# Altium schematic sheet Boost Converter.SchDoc
size B; SheetNumber: 2; SheetTotal: 7
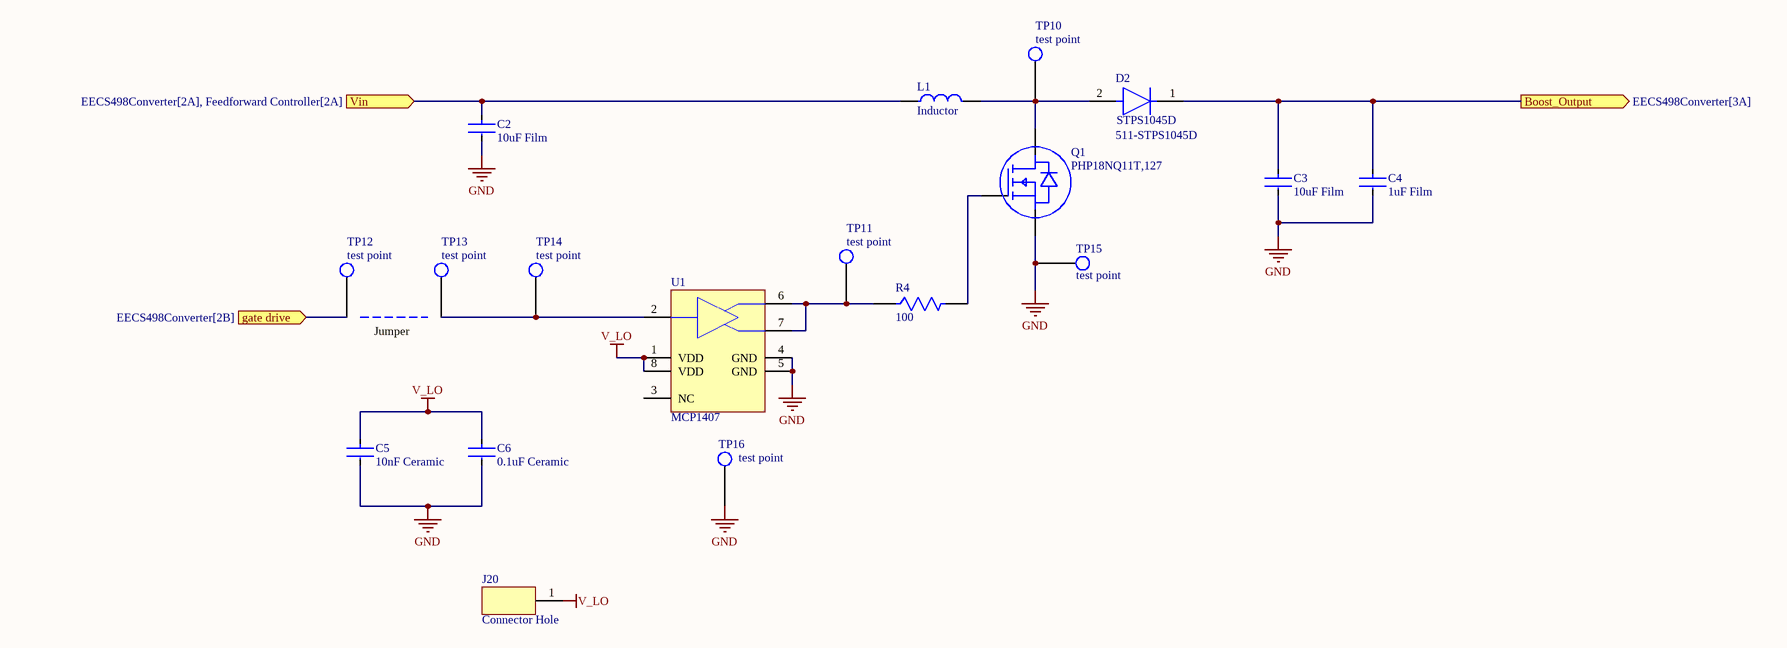
[diagram p0: Boost Converter.SchDoc]

## Parts
C2  10uF Film  [FP-FILM-CAP-22.5mm]
C3  10uF Film  [FP-FILM-CAP-22.5mm]
C4  1uF Film  [FP-FILM-CAP-10mm]
C5  10nF Ceramic  [FP-K15H5-MFG]
C6  0.1uF Ceramic  [FP-K15H5-MFG]
D2  STPS1045D  Supplier Part Number 1: 511-STPS1045D  [STPS1045D]
J20  Connector Hole  [Connector Hole]
L1  Inductor  [Power Inductor]
Q1  PHP18NQ11T,127  [1727-PHP18NQ11T,127-ND]
R4  100  [FP-RLR07-MFG]
TP10  test point  [test point]
TP11  test point  [test point]
TP12  test point  [test point]
TP13  test point  [test point]
TP14  test point  [test point]
TP15  test point  [test point]
TP16  test point  [test point]
U1  MCP1407  [DIP8]

## Ports
Boost_Output (out, see EECS498Converter[3A]), gate drive (in, see EECS498Converter[2B]), Vin (in, see EECS498Converter[2A], Feedforward Controller[2A])

## Nets
GND: C2.2 C3.2 C4.2 C5.2 C6.2 Q1.3(S) TP15.1 TP16.1 U1.4(GND) U1.5(GND)
V_LO: C5.1 C6.1 J20.1 U1.1(VDD) U1.8(VDD)
Boost_Output: C3.1 C4.1 D2.1(K) ; port Boost_Output
gate drive: TP12.1 ; port gate drive
Vin: C2.1 L1.1 ; port Vin
NetD2_2: D2.2(A) L1.2 Q1.2(D) TP10.1
NetQ1_1: Q1.1(G) R4.2
NetR4_1: R4.1 TP11.1 U1.6(OUT) U1.7(OUT)
NetTP13_1: TP13.1 TP14.1 U1.2(IN)

Not connected (* = marked no-connect by the designer): U1 3(NC)

## Notes on the sheet
- Jumper

## Library data of the parts
C2 C3 = 10uF Capacitor: CAP CER 10UF 50V X7R FILM; Capacitance: 100nF; Tolerance: 10%; Dielectric Material: Ceramic; Lead Length: 30mm; Lead Diameter: 0.5mm; Lead/Base Style: Formed Leads; Diameter: 500um; Max Operating Temperature: 125°C; Case/Package: Dipped; Dielectric: X7R; Lead Free: Lead Free; Construction: RADIAL; Voltage: 50V; Thickness: 2.6mm; Min Operating Temperature: -55°C; Lead Pitch: 5mm; Height: 4mm; Radiation Hardening: No; Voltage Rating: 50V; Depth: 2.5mm; Voltage Rating (DC): 50V; Package Quantity: 1; Weight: 0.005644oz; Series: K; Mount: Through Hole; Termination: Radial; Height - Seated (Max): 0.257inch; Length: 4mm; Packaging: Tape and Reel; Width: 2.5mm; RoHS Compliant: Yes
C4 = 1uf Capacitor: CAP CER 1UF 50V X7R FILM; Capacitance: 100nF; Tolerance: 10%; Dielectric Material: Ceramic; Lead Length: 30mm; Lead Diameter: 0.5mm; Lead/Base Style: Formed Leads; Diameter: 500um; Max Operating Temperature: 125°C; Case/Package: Dipped; Dielectric: X7R; Lead Free: Lead Free; Construction: RADIAL; Voltage: 50V; Thickness: 2.6mm; Min Operating Temperature: -55°C; Lead Pitch: 5mm; Height: 4mm; Radiation Hardening: No; Voltage Rating: 50V; Depth: 2.5mm; Voltage Rating (DC): 50V; Package Quantity: 1; Weight: 0.005644oz; Series: K; Mount: Through Hole; Termination: Radial; Height - Seated (Max): 0.257inch; Length: 4mm; Packaging: Tape and Reel; Width: 2.5mm; RoHS Compliant: Yes
C5 = 10nF Capacitor: CAP CER 10nF 50V X7R RADIAL; Capacitance: 100nF; Tolerance: 10%; Lead Length: 30mm; Lead Diameter: 0.5mm; Lead/Base Style: Formed Leads; Diameter: 500um; Max Operating Temperature: 125°C; Dielectric Material: Ceramic; Case/Package: Dipped; Dielectric: X7R; Lead Free: Lead Free; Construction: RADIAL; Voltage: 50V; Thickness: 2.6mm; Min Operating Temperature: -55°C; Lead Pitch: 5mm; Height: 4mm; Radiation Hardening: No; Voltage Rating: 50V; Depth: 2.5mm; Voltage Rating (DC): 50V; Package Quantity: 1; Weight: 0.005644oz; Series: K; Mount: Through Hole; Termination: Radial; Height - Seated (Max): 0.257inch; Length: 4mm; Packaging: Tape and Reel; Width: 2.5mm; RoHS Compliant: Yes
C6 = 0.1uF Capacitor: CAP CER 0.1UF 50V X7R RADIAL; Capacitance: 100nF; Tolerance: 10%; Lead Length: 30mm; Lead Diameter: 0.5mm; Lead/Base Style: Formed Leads; Diameter: 500um; Max Operating Temperature: 125°C; Dielectric Material: Ceramic; Case/Package: Dipped; Dielectric: X7R; Lead Free: Lead Free; Construction: RADIAL; Voltage: 50V; Thickness: 2.6mm; Min Operating Temperature: -55°C; Lead Pitch: 5mm; Height: 4mm; Radiation Hardening: No; Voltage Rating: 50V; Depth: 2.5mm; Voltage Rating (DC): 50V; Package Quantity: 1; Weight: 0.005644oz; Series: K; Mount: Through Hole; Termination: Radial; Height - Seated (Max): 0.257inch; Length: 4mm; Packaging: Tape and Reel; Width: 2.5mm; RoHS Compliant: Yes
D2 = STPS1045D: Diode 45 V 10A Through Hole TO-220AC; Supplier 1: Mouser
L1 = Inductor: DC Current: 180mA; Tolerance: 10%; Core Material: Ferrite; Q Factor: 27; Self Resonant Frequency: 25MHz; Shielding: Unshielded; Test Frequency: 1MHz; Inductance: 10uH; Series Resistance: 1.6R; Radiation Hardening: No; REACH SVHC: No SVHC; Width: 0.098inch; RoHS Compliant: Yes; Case/Package: 1210; Package Quantity: 2000; Height - Seated (Max): 0.083inch; Rated Current-Max: 180mA; Series: SIMID; Mount: Surface Mount; Depth: 2.8mm; Resistor Type: Wirewound; Max DC Current: 180mA; Termination: SMD/SMT; Contact Plating: Tin; Height: 2.1mm; Case Code (Metric): 3225; Lead Free: Lead Free; Weight: 0.001764oz; Max Operating Temperature: 125°C; Length: 3.5mm; Packaging: Tape and Reel; Case Code (Imperial): 1210; Inductance Tolerance: 10%; Ratings: AEC-Q200; Number of Pins: 2; Current Rating: 180mA; Military Standard: Not; DC Resistance (DCR): 1.6R
Q1 = PHP18NQ11T,127: N-Channel 110 V 18A (Tc) 79W (Tc) Through Hole TO-220AB; Supplier 1: Digi-Key; Supplier Part Number 1: 1727-PHP18NQ11T,127-ND
R4 = Resistor: Resistor, ± 1%, 250 mW, Axial Leaded, Metal Film, Military Reliability; NexarPartId: 39453770; Max Power Dissipation: 250mW; Resistance: 100kΩ; Lead Length: 38.1mm; Voltage Rating: 250V; Lead Diameter: 640µm; Temperature Coefficient: 100ppm/°C; Wire/Cable Diameter: 50.8µm; Military Standard: MIL-PRF-39017; REACH SVHC: Unknown; Min Operating Temperature: -65°C; Length: 7.62mm; Case/Package: Axial; Lead Free: Contains Lead; Height: 2.5mm; Contact Plating: Lead, Tin; Radiation Hardening: No; Composition: Metal Film; Voltage Rating (DC): 250V; Schedule B: 8533210090, 8533210090|8533210090, 8533210090|8533210090|8533210090, 8533210090|8533210090|8533210090|8533210090; Diameter: 2.29mm; Tolerance: 1%; Max Operating Temperature: 150°C; Number of Terminations: 2; RoHS: Non-Compliant; Features: Military, Moisture Resistant, Weldable; Power Rating: 250mW; Packaging: Bulk; Width: 2.29mm; Termination: Axial; Failure Rate: 0.001%
U1 = MCP1407: 6A High-Speed Power MOSFET Drivers, Non Inverting, Extended Temperature; PackageVersion: revBB, Aug-2009; PackageReference: PDIP300-P8; Code_JEDEC: MS-001; PackageDescription: 8-Lead Plastic Dual In-Line (P) - 300 mil Body [PDIP]; DatasheetVersion: revA, Dec-2006